# Altium schematic sheet 10_RF_2.SchDoc: =TitleParameter
size A2; SheetNumber: 12; SheetTotal: 12
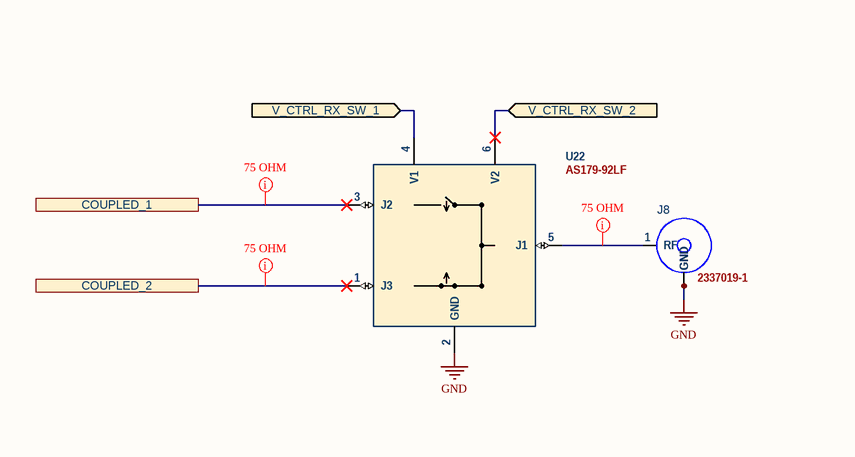
[diagram p0: 10_RF_2.SchDoc, left]
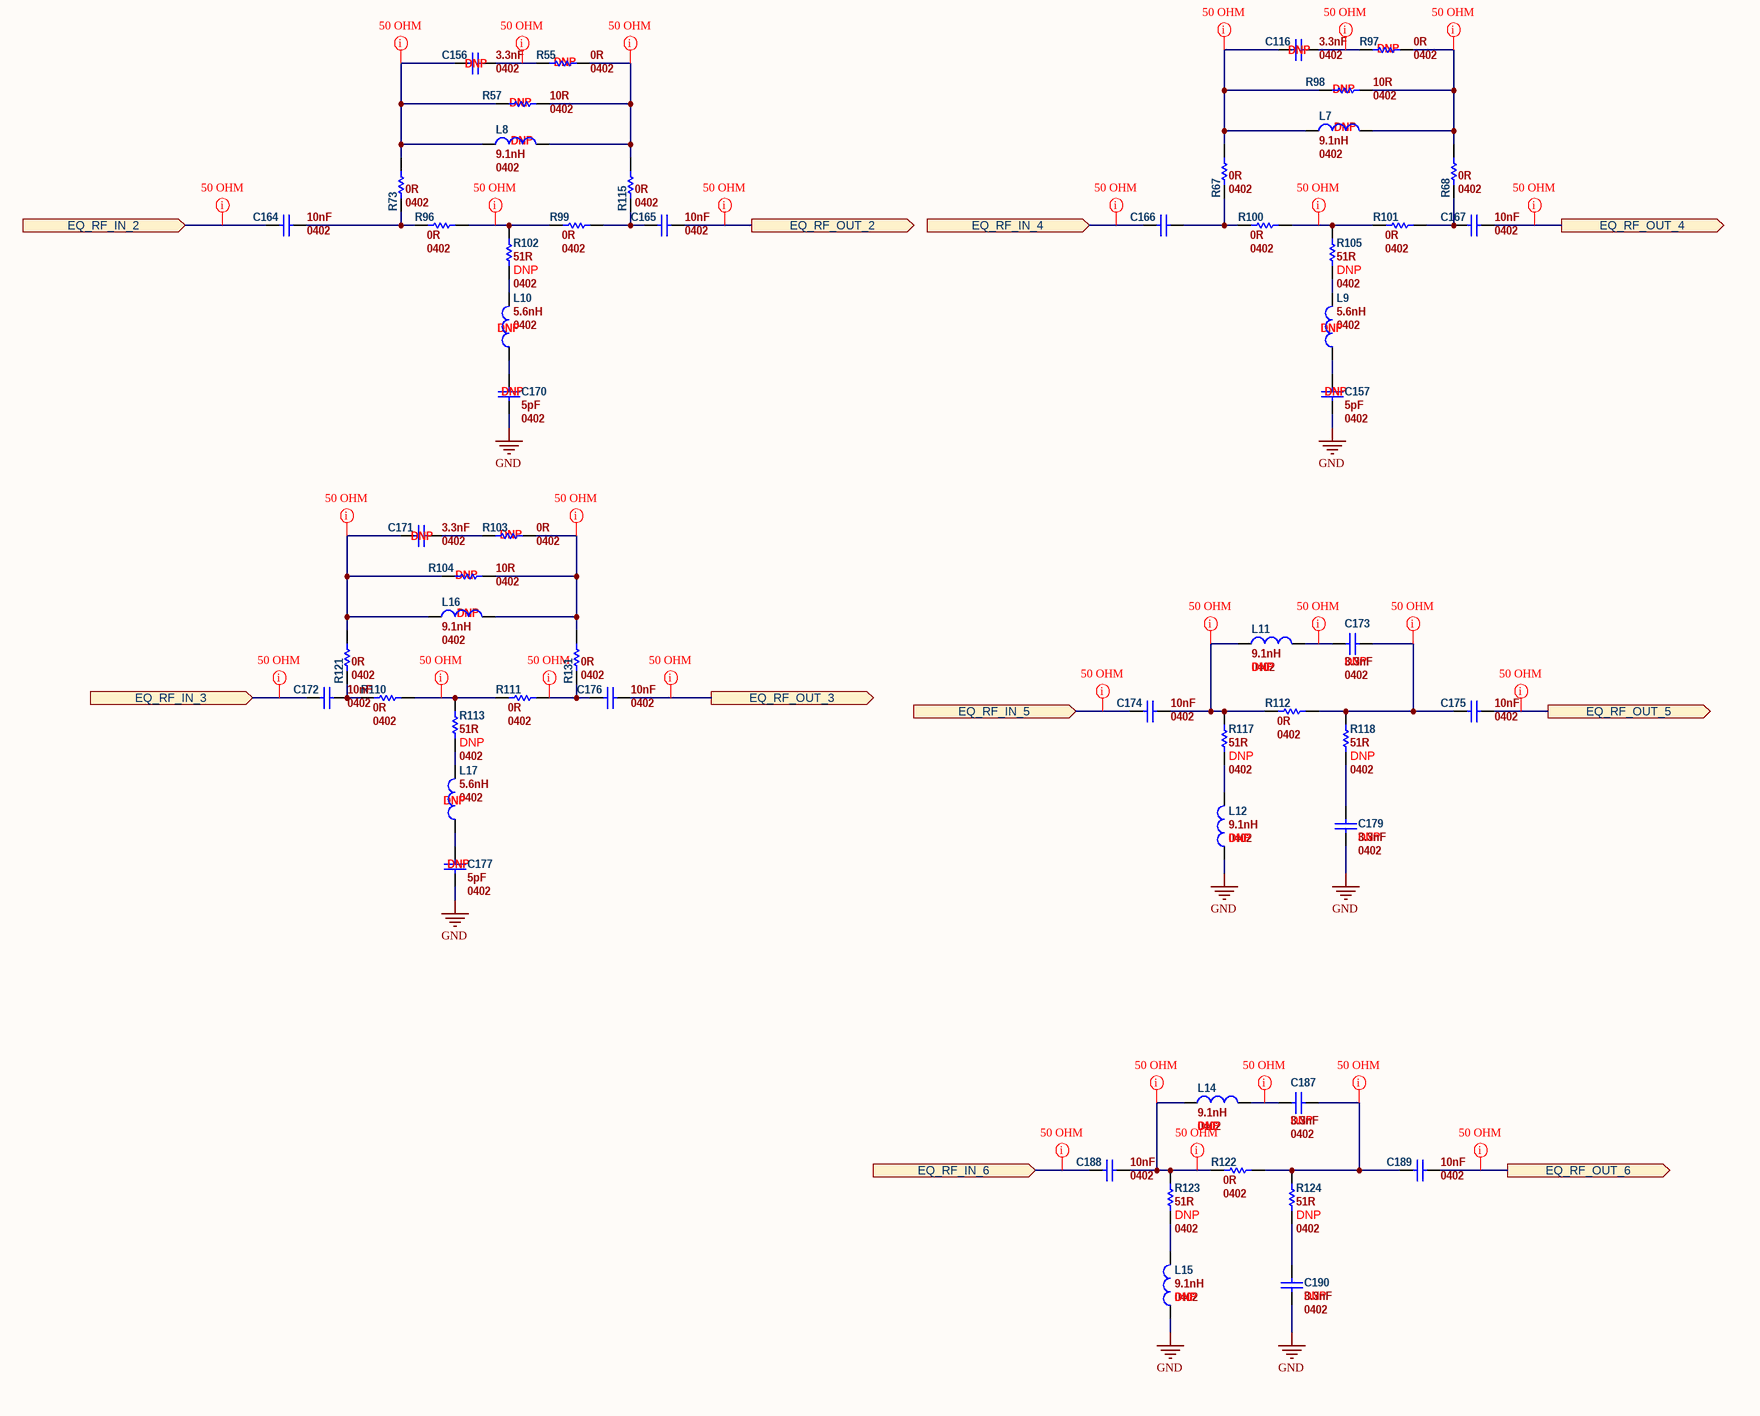
[diagram p1: 10_RF_2.SchDoc, right]

## Parts
C116  value 3.3nF  Assembly: DNP  Package: 0402  [CAP_0402_N]  (hidden comment: C 0402 50V X7R - 3.3nF)
C156  value 3.3nF  Assembly: DNP  Package: 0402  [CAP_0402_N]  (hidden comment: C 0402 50V X7R - 3.3nF)
C157  value 5pF  Assembly: DNP  Package: 0402  [CAP_0402_N]  (hidden comment: C 0402 50V C0G/NP0 - 5pF)
C164  value 10nF  Package: 0402  [CAP_0402_N]  (hidden comment: C 0402 50V X7R - 10nF)
C165  value 10nF  Package: 0402  [CAP_0402_N]  (hidden comment: C 0402 50V X7R - 10nF)
C166  C 0402 50V X7R - 10nF  [CAP_0402_N]  (value not drawn)
C167  value 10nF  Package: 0402  [CAP_0402_N]  (hidden comment: C 0402 50V X7R - 10nF)
C170  value 5pF  Assembly: DNP  Package: 0402  [CAP_0402_N]  (hidden comment: C 0402 50V C0G/NP0 - 5pF)
C171  value 3.3nF  Assembly: DNP  Package: 0402  [CAP_0402_N]  (hidden comment: C 0402 50V X7R - 3.3nF)
C172  value 10nF  Package: 0402  [CAP_0402_N]  (hidden comment: C 0402 50V X7R - 10nF)
C173  value 3.3nF  Assembly: DNP  Package: 0402  [CAP_0402_N]  (hidden comment: C 0402 50V X7R - 3.3nF)
C174  value 10nF  Package: 0402  [CAP_0402_N]  (hidden comment: C 0402 50V X7R - 10nF)
C175  value 10nF  Package: 0402  [CAP_0402_N]  (hidden comment: C 0402 50V X7R - 10nF)
C176  value 10nF  Package: 0402  [CAP_0402_N]  (hidden comment: C 0402 50V X7R - 10nF)
C177  value 5pF  Assembly: DNP  Package: 0402  [CAP_0402_N]  (hidden comment: C 0402 50V C0G/NP0 - 5pF)
C179  value 3.3nF  Assembly: DNP  Package: 0402  [CAP_0402_N]  (hidden comment: C 0402 50V X7R - 3.3nF)
C187  value 3.3nF  Assembly: DNP  Package: 0402  [CAP_0402_N]  (hidden comment: C 0402 50V X7R - 3.3nF)
C188  value 10nF  Package: 0402  [CAP_0402_N]  (hidden comment: C 0402 50V X7R - 10nF)
C189  value 10nF  Package: 0402  [CAP_0402_N]  (hidden comment: C 0402 50V X7R - 10nF)
C190  value 3.3nF  Assembly: DNP  Package: 0402  [CAP_0402_N]  (hidden comment: C 0402 50V X7R - 3.3nF)
J8  2337019-1  [2337019-1]
L7  value 9.1nH  Package: 0402  Assembly: DNP  [IND_0402_N]  (hidden comment: L 0402 500mA - 9.1nH)
L8  value 9.1nH  Package: 0402  Assembly: DNP  [IND_0402_N]  (hidden comment: L 0402 500mA - 9.1nH)
L9  value 5.6nH  Package: 0402  Assembly: DNP  [IND_0402_N]  (hidden comment: L 0402 650mA - 5.6nH)
L10  value 5.6nH  Package: 0402  Assembly: DNP  [IND_0402_N]  (hidden comment: L 0402 650mA - 5.6nH)
L11  value 9.1nH  Package: 0402  Assembly: DNP  [IND_0402_N]  (hidden comment: L 0402 500mA - 9.1nH)
L12  value 9.1nH  Package: 0402  Assembly: DNP  [IND_0402_N]  (hidden comment: L 0402 500mA - 9.1nH)
L14  value 9.1nH  Package: 0402  Assembly: DNP  [IND_0402_N]  (hidden comment: L 0402 500mA - 9.1nH)
L15  value 9.1nH  Package: 0402  Assembly: DNP  [IND_0402_N]  (hidden comment: L 0402 500mA - 9.1nH)
L16  value 9.1nH  Package: 0402  Assembly: DNP  [IND_0402_N]  (hidden comment: L 0402 500mA - 9.1nH)
L17  value 5.6nH  Package: 0402  Assembly: DNP  [IND_0402_N]  (hidden comment: L 0402 650mA - 5.6nH)
R55  value 0R  Assembly: DNP  Package: 0402  [RES_0402_N]  (hidden comment: R 0402 1/10W - 0R)
R57  value 10R  Assembly: DNP  Package: 0402  [RES_0402_N]  (hidden comment: R 0402 1/10W 1% - 10R)
R67  value 0R  Package: 0402  [RES_0402_N]  (hidden comment: R 0402 1/10W - 0R)
R68  value 0R  Package: 0402  [RES_0402_N]  (hidden comment: R 0402 1/10W - 0R)
R73  value 0R  Package: 0402  [RES_0402_N]  (hidden comment: R 0402 1/10W - 0R)
R96  value 0R  Package: 0402  [RES_0402_N]  (hidden comment: R 0402 1/10W - 0R)
R97  value 0R  Assembly: DNP  Package: 0402  [RES_0402_N]  (hidden comment: R 0402 1/10W - 0R)
R98  value 10R  Assembly: DNP  Package: 0402  [RES_0402_N]  (hidden comment: R 0402 1/10W 1% - 10R)
R99  value 0R  Package: 0402  [RES_0402_N]  (hidden comment: R 0402 1/10W - 0R)
R100  value 0R  Package: 0402  [RES_0402_N]  (hidden comment: R 0402 1/10W - 0R)
R101  value 0R  Package: 0402  [RES_0402_N]  (hidden comment: R 0402 1/10W - 0R)
R102  value 51R  Assembly: DNP  Package: 0402  [RES_0402_N]  (hidden comment: R 0402 1/10W 1% - 51R)
R103  value 0R  Assembly: DNP  Package: 0402  [RES_0402_N]  (hidden comment: R 0402 1/10W - 0R)
R104  value 10R  Assembly: DNP  Package: 0402  [RES_0402_N]  (hidden comment: R 0402 1/10W 1% - 10R)
R105  value 51R  Assembly: DNP  Package: 0402  [RES_0402_N]  (hidden comment: R 0402 1/10W 1% - 51R)
R110  value 0R  Package: 0402  [RES_0402_N]  (hidden comment: R 0402 1/10W - 0R)
R111  value 0R  Package: 0402  [RES_0402_N]  (hidden comment: R 0402 1/10W - 0R)
R112  value 0R  Package: 0402  [RES_0402_N]  (hidden comment: R 0402 1/10W - 0R)
R113  value 51R  Assembly: DNP  Package: 0402  [RES_0402_N]  (hidden comment: R 0402 1/10W 1% - 51R)
R115  value 0R  Package: 0402  [RES_0402_N]  (hidden comment: R 0402 1/10W - 0R)
R117  value 51R  Assembly: DNP  Package: 0402  [RES_0402_N]  (hidden comment: R 0402 1/10W 1% - 51R)
R118  value 51R  Assembly: DNP  Package: 0402  [RES_0402_N]  (hidden comment: R 0402 1/10W 1% - 51R)
R121  value 0R  Package: 0402  [RES_0402_N]  (hidden comment: R 0402 1/10W - 0R)
R122  value 0R  Package: 0402  [RES_0402_N]  (hidden comment: R 0402 1/10W - 0R)
R123  value 51R  Assembly: DNP  Package: 0402  [RES_0402_N]  (hidden comment: R 0402 1/10W 1% - 51R)
R124  value 51R  Assembly: DNP  Package: 0402  [RES_0402_N]  (hidden comment: R 0402 1/10W 1% - 51R)
R131  value 0R  Package: 0402  [RES_0402_N]  (hidden comment: R 0402 1/10W - 0R)
U22  AS179-92LF  [SC70_SOT-363]

## Ports
COUPLED_1, COUPLED_2, EQ_RF_IN_2 (in), EQ_RF_IN_3 (in), EQ_RF_IN_4 (in), EQ_RF_IN_5 (in), EQ_RF_IN_6 (in), EQ_RF_OUT_2 (out), EQ_RF_OUT_3 (out), EQ_RF_OUT_4 (out), EQ_RF_OUT_5 (out), EQ_RF_OUT_6 (out), V_CTRL_RX_SW_1 (in), V_CTRL_RX_SW_2 (in)

## Nets
GND: C157.1 C170.1 C177.1 C179.1 C190.1 J8.G1(GND) J8.G2(GND) L12.1 L15.1 U22.2(GND)
COUPLED_1: U22.3(J2) ; port COUPLED_1
COUPLED_2: U22.1(J3) ; port COUPLED_2
EQ_RF_IN_2: C164.1 ; port EQ_RF_IN_2
EQ_RF_IN_3: C172.1 ; port EQ_RF_IN_3
EQ_RF_IN_4: C166.1 ; port EQ_RF_IN_4
EQ_RF_IN_5: C174.1 ; port EQ_RF_IN_5
EQ_RF_IN_6: C188.1 ; port EQ_RF_IN_6
EQ_RF_OUT_2: C165.2 ; port EQ_RF_OUT_2
EQ_RF_OUT_3: C176.2 ; port EQ_RF_OUT_3
EQ_RF_OUT_4: C167.2 ; port EQ_RF_OUT_4
EQ_RF_OUT_5: C175.2 ; port EQ_RF_OUT_5
EQ_RF_OUT_6: C189.2 ; port EQ_RF_OUT_6
V_CTRL_RX_SW_1: U22.4(V1) ; port V_CTRL_RX_SW_1
V_CTRL_RX_SW_2: U22.6(V2) ; port V_CTRL_RX_SW_2
NetC116_1: C116.1 L7.1 R67.2 R98.1
NetC116_2: C116.2 R97.1
NetC156_1: C156.1 L8.1 R57.1 R73.2
NetC156_2: C156.2 R55.1
NetC157_2: C157.2 L9.1
NetC164_2: C164.2 R73.1 R96.1
NetC165_1: C165.1 R99.2 R115.1
NetC166_2: C166.2 R67.1 R100.1
NetC167_1: C167.1 R68.1 R101.2
NetC170_2: C170.2 L10.1
NetC171_1: C171.1 L16.1 R104.1 R121.2
NetC171_2: C171.2 R103.1
NetC172_2: C172.2 R110.1 R121.1
NetC173_1: C173.1 C175.1 R112.2 R118.2
NetC173_2: C173.2 L11.2
NetC174_2: C174.2 L11.1 R112.1 R117.2
NetC176_1: C176.1 R111.2 R131.1
NetC177_2: C177.2 L17.1
NetC179_2: C179.2 R118.1
NetC187_1: C187.1 C189.1 R122.2 R124.2
NetC187_2: C187.2 L14.2
NetC188_2: C188.2 L14.1 R122.1 R123.2
NetC190_2: C190.2 R124.1
NetJ8_1: J8.1(RF) U22.5(J1)
NetL7_2: L7.2 R68.2 R97.2 R98.2
NetL8_2: L8.2 R55.2 R57.2 R115.2
NetL9_2: L9.2 R105.1
NetL10_2: L10.2 R102.1
NetL12_2: L12.2 R117.1
NetL15_2: L15.2 R123.1
NetL16_2: L16.2 R103.2 R104.2 R131.2
NetL17_2: L17.2 R113.1
NetR96_2: R96.2 R99.1 R102.2
NetR100_2: R100.2 R101.1 R105.2
NetR110_2: R110.2 R111.1 R113.2

## Layout directives
net class RF_50_OHM; rule Width Constraint [Pref Impedance = 50.00ohms    Min Impedance = 50.00ohms    Max Impedance = 50.00ohms]: EQ_RF_IN_2, EQ_RF_IN_3, EQ_RF_IN_4, EQ_RF_IN_5, EQ_RF_IN_6, EQ_RF_OUT_2, EQ_RF_OUT_3, EQ_RF_OUT_4, EQ_RF_OUT_5, EQ_RF_OUT_6, NetC116_1, NetC116_2, NetC156_1, NetC156_2, NetC171_1, NetC173_1, NetC173_2, NetC174_2, NetC176_1, NetC187_1, NetC187_2, NetC188_2, NetL7_2, NetL8_2, NetL16_2, NetR96_2, NetR100_2, NetR110_2
net class RF_75_OHM; rule Width Constraint [Pref Impedance = 50.00ohms    Min Impedance = 50.00ohms    Max Impedance = 50.00ohms]: COUPLED_1, COUPLED_2, NetJ8_1

## Notes on the sheet
- Proje/Project:
- Sayfa Adı/Document Name:
- Çizilme Tarihi/Drawing Date
- Son Güncelleme/Last Edit Date
- E. CAGLAV
- Tasarlayan/Designed By
- Kontrol eden/Checked By
- Boyut/Size:
- Sayfa/Sheet:
- Revision:
- A3
- of
- Onaylayan/Approved By
- Varyant/Variant:
- Dil/Language:
- ENG

## Library data of the parts
C116 C156 C171 C173 C179 C187 C190 = C 0402 50V X7R - 3.3nF: CAP CER 3.3nF 50V X7R 0402 ±5%; Manufacturer 1: MURATA ELECTRONICS; Manufacturer Part Number 1: GRM155R71H332JA01D; Location: NA; MSL Level: Level-1; MaxHeight_mm: 0.55; M_Number_of_Pins: 2; Check: Approved; UnitPrice: 0.1; PackageType: SMD; Tolerance: ±5%; ComponentLink2Description: Datasheet; Status: Active; ComponentLink3Description: DigiKey; ComponentLink3URL: https://www.digikey.com/en/products/detail/murata-electronics/GRM155R71H332JA01D/5251319?utm_adgroup=&utm_source=google&utm_medium=cpc&utm_campaign=Pmax_Product_All%20Products&utm_term=&utm_content=&utm_id=go_cmp-18790247214_adg-_ad-__dev-c_ext-_prd-_sig-EAIaIQobChMI-qDC4avGhQMVhkVBAh32KAqJEAAYAiAAEgIqzvD_BwE&gad_source=1&gclid=EAIaIQobChMI-qDC4avGhQMVhkVBAh32KAqJEAAYAiAAEgIqzvD_BwE; M_AmpersPerContact: NA; M_Duty Cycle(%): NA; M_MatingCycle: NA; M_Number_of_Bits(K): NA; M_Number_of_Transistors_Gates_or_Bits: NA; M_OperatingPower(W): NA; M_ProgrammingCycles: NA; M_RatedPower(W): NA; M_RatedVoltage(V): 50V; M_ThermalResistance(θJABC)(°C/W): NA; Supplier 1: Digi-Key; Supplier Part Number 1: 490-10780-2-ND
C157 C170 C177 = C 0402 50V C0G/NP0 - 5pF: CAP CER 5pF 50V C0G/NP0 0402 ±0.1pF; Manufacturer 1: MURATA; Manufacturer Part Number 1: GJM1555C1H5R0BB01D; Location: NA; MSL Level: Level-1; MaxHeight_mm: 0.55; M_Number_of_Pins: 2; M_RatedVoltage(V): 50; Check: Approved; UnitPrice: 0.14; PackageType: SMD; Tolerance: ±0.1pF; ComponentLink2Description: Datasheet; Status: Active; ComponentLink3Description: DigiKey; ComponentLink3URL: https://www.digikey.com/en/products/detail/murata-electronics/GJM1555C1H5R0BB01D/2593016; M_AmpersPerContact: NA; M_Duty Cycle(%): NA; M_MatingCycle: NA; M_Number_of_Bits(K): NA; M_Number_of_Transistors_Gates_or_Bits: NA; M_OperatingPower(W): NA; M_ProgrammingCycles: NA; M_RatedPower(W): NA; M_ThermalResistance(θJABC)(°C/W): NA; Supplier 1: Digi-Key; Supplier Part Number 1: 490-8103-2-ND
C164-C167 C172 C174-C176 C188 C189 = C 0402 50V X7R - 10nF: CAP CER 10nF 50V X7R 0402 ±10%; Manufacturer 1: KEMET; Manufacturer Part Number 1: C0402C103K5RAC7867; Location: NA; MSL Level: Level-1; MaxHeight_mm: 0.55; M_Number_of_Pins: 2; M_RatedVoltage(V): 50; Check: Approved; UnitPrice: 0.1; PackageType: SMD; Tolerance: ±10%; ComponentLink2Description: Datasheet; Status: Active; ComponentLink3Description: DigiKey; ComponentLink3URL: https://www.digikey.com/en/products/detail/kemet/C0402C103K5RAC7867/501968; M_AmpersPerContact: NA; M_Duty Cycle(%): NA; M_ESR(mΩ): NA; M_MatingCycle: NA; M_Number_of_Bits(K): NA; M_Number_of_Transistors_Gates_or_Bits: NA; M_OperatingPower(W): NA; M_ProgrammingCycles: NA; M_RatedPower(W): NA; M_ThermalResistance(θJABC)(°C/W): NA; Supplier 1: Digi-Key; Supplier Part Number 1: 399-C0402C103K5RAC7867TR-ND
J8 = 2337019-1: CONN UMCC(UFL) COAX MALE 50 OHM SMD -40°C~85°C; Manufacturer 1: TE CONNECTIVITY AMP CONNECTORS; Location: NA; MaxHeight_mm: 1.25; Check: Approved; ComponentLink1Description: Digi-Key; ComponentLink1URL: https://www.digikey.com/en/products/detail/te-connectivity-amp-connectors/2337019-1/9974052; Manufacturer Part Number 1: 2337019-1; UnitPrice: 0.19; Status: Active; PackageType: SMD; Supplier 1: Digi-Key; Supplier Part Number 1: A144746TR-ND; Package: 2337019-1; Value: 2337019-1
L7 L8 L11 L12 L14-L16 = L 0402 500mA - 9.1nH: IND 9.1nH 500mA 270mΩ DCR 0402 ±5% -55°C~125°C; Manufacturer 1: MURATA ELECTRONICS; Manufacturer Part Number 1: LQG15HN9N1J02D; Location: NA; MSL Level: Level-1; MaxHeight_mm: 0.5; M_Number_of_Pins: 2; Check: Approved; UnitPrice: 0.1; PackageType: SMD; Tolerance: ±5%; ComponentLink2Description: Datasheet; ComponentLink2URL: D:\SAVRONIK_SVN\Donanım\trunk\ALTIUM\Central Library\Datasheets\Inductor\LQG15HN9N1J02D_Datasheet.pdf; Status: Active; M_AmpersPerContact: NA; M_Duty Cycle(%): NA; M_ESR(mΩ): NA; M_Frequency(MHz): NA; M_MatingCycle: NA; M_Number_of_Bits(K): NA; M_Number_of_Transistors_Gates_or_Bits: NA; M_OperatingVoltage(V): NA; M_ProgrammingCycles: NA; M_RatedPower(W): NA; M_RatedVoltage(V): NA; M_OperatingPower(W): NA; M_ThermalResistance(θJABC)(°C/W): NA; Supplier 1: Digikey; Supplier Part Number 1: 490-6566-6-ND; ComponentLink1Description: Digikey; ComponentLink1URL: https://www.digikey.com/en/products/detail/murata-electronics/LQG15HN9N1J02D/2594215
L9 L10 L17 = L 0402 650mA - 5.6nH: IND 5.6nH 650mA 200mΩ DCR 0402 ±0.3nH -55°C~125°C; Manufacturer 1: MURATA ELECTRONICS; Manufacturer Part Number 1: LQG15HS5N6S02D; Location: NA; MSL Level: Level-1; MaxHeight_mm: 0.6; M_Number_of_Pins: 2; Check: Approved; UnitPrice: 0.1; PackageType: SMD; Tolerance: ±0.3nH; ComponentLink2Description: Datasheet; ComponentLink2URL: D:\SAVRONIK_SVN\Donanım\trunk\ALTIUM\Central Library\Datasheets\Inductor\LQG15HS5N6S02D_Datasheet.pdf; Status: Active; M_AmpersPerContact: NA; M_Duty Cycle(%): NA; M_ESR(mΩ): NA; M_Frequency(MHz): NA; M_MatingCycle: NA; M_Number_of_Bits(K): NA; M_Number_of_Transistors_Gates_or_Bits: NA; M_OperatingVoltage(V): NA; M_ProgrammingCycles: NA; M_RatedPower(W): NA; M_RatedVoltage(V): NA; M_OperatingPower(W): NA; M_ThermalResistance(θJABC)(°C/W): NA; Supplier 1: Digikey; Supplier Part Number 1: 490-2619-2-ND; ComponentLink1Description: Digikey; ComponentLink1URL: https://www.digikey.com/en/products/detail/murata-electronics/LQG15HS5N6S02D/662868?s=N4IgTCBcDaIDIEUDiBGArACQMpoHIDYsAGMAERAF0BfIA
R55 R67 R68 R73 R96 R97 R99-R101 R103 R110-R112 R115 R121 R122 R131 = R 0402 1/10W - 0R: RES 0R 1/10W 0402; Manufacturer 1: PANASONIC ELECTRONIC COMPONENTS; Manufacturer Part Number 1: ERJ-2GE0R00X; Location: NA; MSL Level: Level-1; MaxHeight_mm: 0.4; Check: Approved; ComponentLink1Description: Digi-Key; ComponentLink1URL: https://www.digikey.com/en/products/detail/panasonic-electronic-components/ERJ-2GE0R00X/146727?utm_adgroup=&utm_source=google&utm_medium=cpc&utm_campaign=Pmax_Product_All%20Products&utm_term=&utm_content=&utm_id=go_cmp-18790247214_adg-_ad-__dev-c_ext-_prd-_sig-EAIaIQobChMI6dXOvs-qgwMVM4loCR0TKwG5EAAYASAAEgIbCfD_BwE&gad_source=1&gclid=EAIaIQobChMI6dXOvs-qgwMVM4loCR0TKwG5EAAYASAAEgIbCfD_BwE; UnitPrice: 0.1; PackageType: SMD; Status: Active; ComponentLink2Description: Datasheet; Supplier 1: Digikey; Supplier Part Number 1: P0.0JTR-ND
R57 R98 R104 = R 0402 1/10W 1% - 10R: RES 10R 1/10W 0402 1%; Manufacturer 1: PANASONIC ELECTRONIC COMPONENTS; Manufacturer Part Number 1: ERJ-2RKF10R0X; Location: NA; MSL Level: Level-1; MaxHeight_mm: 0.4; Check: Approved; ComponentLink1Description: Digi-Key; ComponentLink1URL: https://www.digikey.com/en/products/detail/panasonic-electronic-components/erj-2rkf10r0x/192072; UnitPrice: 0.1; PackageType: SMD; Tolerance: ±1%; ComponentLink2Description: Datasheet; Status: Active; Supplier 1: Digikey; Supplier Part Number 1: P10.0LTR-ND
R102 R105 R113 R117 R118 R123 R124 = R 0402 1/10W 1% - 51R: RES 51R 1/10W 0402 1%; Manufacturer 1: KOA SPEER ELECTRONICS, INC.; Manufacturer Part Number 1: RK73H1ETTP51R0F; Location: NA; MSL Level: Level-1; MaxHeight_mm: 0.4; Check: Approved; M_Number_of_Pins: 2; M_RatedPower(W): 0.1; UnitPrice: 0.1; PackageType: SMD; Tolerance: ±1%; Status: Active; M_AmpersPerContact: NA; M_Duty Cycle(%): NA; M_ESR(mΩ): NA; M_Frequency(MHz): NA; M_MatingCycle: NA; M_Number_of_Bits(K): NA; M_Number_of_Transistors_Gates_or_Bits: NA; M_OperatingVoltage(V): NA; M_ProgrammingCycles: NA; M_RatedVoltage(V): NA; M_ThermalResistance(θJABC)(°C/W): NA; Supplier 1: Digikey; Supplier Part Number 1: 2019-RK73H1ETTP51R0FTR-ND
U22 = AS179-92LF: IC RF SWITCH SP2T 0.02-4GHZ SC-70 -40°C~85°C; Manufacturer 1: SKYWORKS SOLUTIONS; H-Stock#: NA; MSL Level: Level-1; MaxHeight_mm: 1; M_Number_of_Pins: 6; Check: Approved; ComponentLink1Description: Digi-Key; ComponentLink1URL: https://www.digikey.com/en/products/detail/skyworks-solutions-inc/AS179-92LF/2052013; Location: NA; Manufacturer Part Number 1: AS179-92LF; UnitPrice: 0.84; Status: Active; PackageType: SMD; ComponentLink2Description: Datasheet; ComponentLink2URL: D:\IFF\IFF_Library\Datasheets\IC\AS179-92LF_Datasheet.pdf; Package: SC-70; M_AmpersPerContact: NA; M_Duty Cycle(%): NA; M_ESR(mΩ): NA; M_Frequency(MHz): NA; M_MatingCycle: NA; M_Number_of_Bits(K): NA; M_Number_of_Transistors_Gates_or_Bits: NA; M_ProgrammingCycles: NA; Supplier 1: Digi-Key; Supplier Part Number 1: 863-1003-2-ND; Value: AS179-92LF